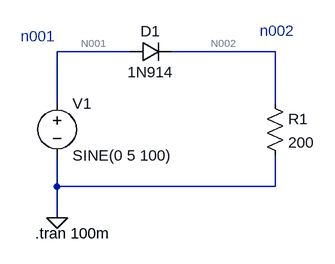
[diagram p0: schematic Yoneda-p85__Rectification-circuit.asc]
Yoneda-p85__Rectification-circuit.asc, the LTspice schematic file:
Version 4
SHEET 1 880 680
WIRE 192 0 80 0
WIRE 416 0 256 0
WIRE 80 80 80 0
WIRE 416 80 416 0
WIRE 80 208 80 160
WIRE 416 208 416 160
WIRE 416 208 80 208
WIRE 80 256 80 208
FLAG 80 256 0
SYMBOL diode 192 -16 M90
WINDOW 0 0 32 VBottom 2
WINDOW 3 32 32 VTop 2
SYMATTR InstName D1
SYMATTR Value 1N914
SYMBOL res 400 64 R0
SYMATTR InstName R1
SYMATTR Value 200
SYMBOL voltage 80 64 R0
WINDOW 123 0 0 Left 2
WINDOW 39 0 0 Left 2
SYMATTR InstName V1
SYMATTR Value SINE(0 5 100)
TEXT 46 280 Left 2 !.tran 100m
TEXT 24 -24 Left 2 ;n001
TEXT 392 -32 Left 2 ;n002

The netlist it stands for:
* Yoneda-p85__Rectification-circuit.asc
D1 N001 N002 1N914
R1 N002 0 200
V1 N001 0 SINE(0 5 100)
.model D D
.lib standard.dio
.tran 100m
* n001
* n002
.backanno
.end

* Results of the author's LTspice run, read from the files saved beside the schematic
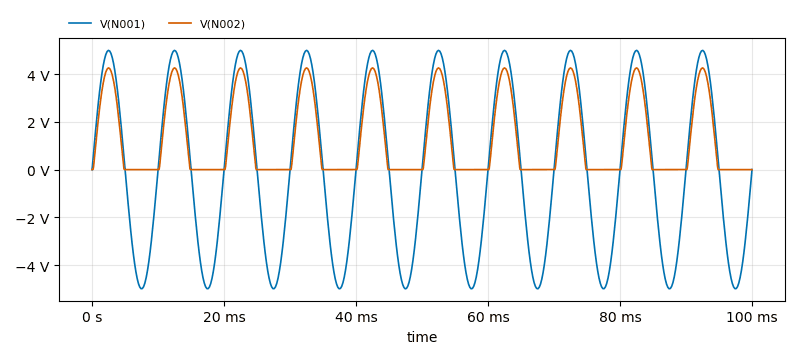
[diagram p1: Transient Analysis of Yoneda-p85__Rectification-circuit.asc, plotted from the saved traces]
* Transient Analysis, 1 run:
*   V(N001): min -4.993 V, max 4.995 V, average 72.85 µV, rms 3.531 V, last 0 V
*   V(N002): min -2.741 µV, max 4.26 V, average 1.254 V, rms 2.05 V, last 2.204 µV